# Altium schematic sheet MCU.SchDoc
size A4; PageSetup: Record=PageOptions|CenterHorizontal=True|CenterVertical=True|PrintScale=0.97|XCorrection=1.00|YCorrection=1.00|PrintKind=2|BorderSize=5000000|LeftOffset=0|BottomOffset=0|Orientation=2|PaperLength=1000|PaperWidth=1000|Scale=100|PaperSource=7|PrintQuality=-3|MediaType=1|DitherType=10|PrintScaleMode=1|PaperKind=A4|PaperIndex=9
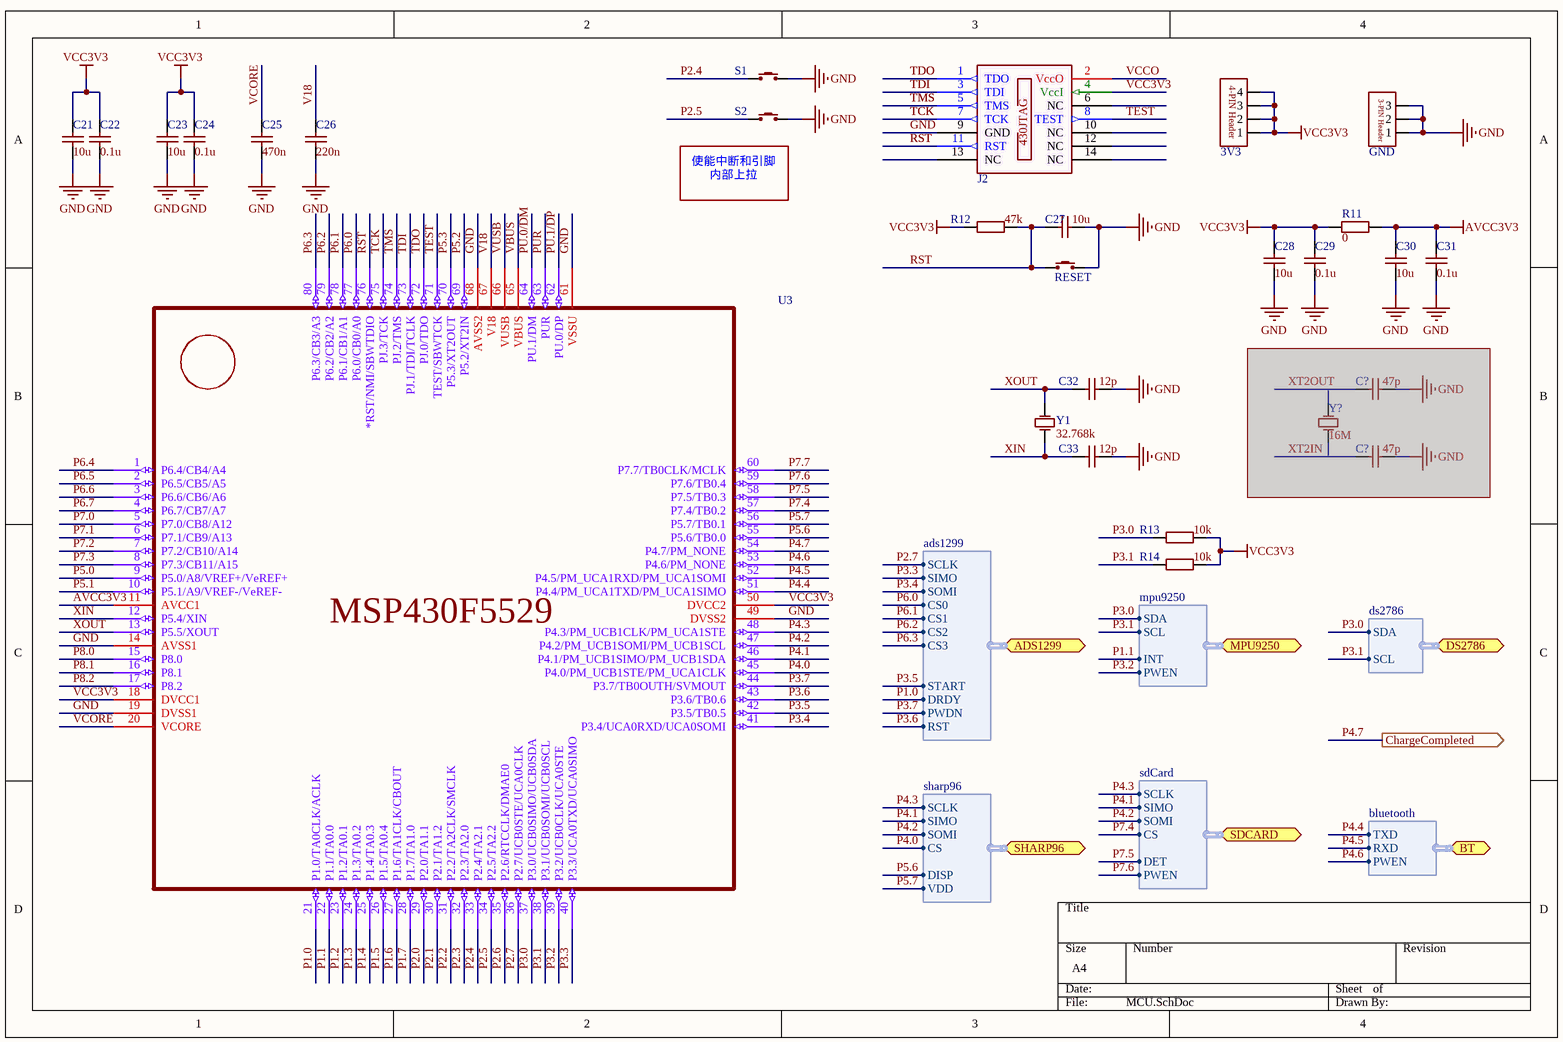
[diagram p0: MCU.SchDoc]

## Parts
(Parts that share a designator on the sheet are numbered #1, #2 ... from top to bottom, then left to right.)
3V3  Header 1X4  [排针1X4 2.54mm]  (value not drawn)
C21  value 10u  [C0402_h]  (hidden comment: Capacitor)
C22  value 0.1u  [C0402_h]  (hidden comment: Capacitor)
C23  value 10u  [C0402_h]  (hidden comment: Capacitor)
C24  value 0.1u  [C0402_h]  (hidden comment: Capacitor)
C25  value 470n  [C0402_h]  (hidden comment: Capacitor)
C26  value 220n  [C0402_h]  (hidden comment: Capacitor)
C27  value 10u  [C0402_h]  (hidden comment: Capacitor)
C28  value 10u  [C0402_h]  (hidden comment: Capacitor)
C29  value 0.1u  [C0402_h]  (hidden comment: Capacitor)
C30  value 10u  [C0402_h]  (hidden comment: Capacitor)
C31  value 0.1u  [C0402_h]  (hidden comment: Capacitor)
C32  value 12p  [C0402_h]  (hidden comment: Capacitor)
C33  value 12p  [C0402_h]  (hidden comment: Capacitor)
C?#1  value 47p  [C0402_h]  (hidden comment: Capacitor)  (masked out: inside a compile mask, not in the netlist)
C?#2  value 47p  [C0402_h]  (hidden comment: Capacitor)  (masked out: inside a compile mask, not in the netlist)
GND  Header1X3  [排针1X3 2.54mm]  (value not drawn)
J2  430JTAG_14  [IDC 2X7]  (value not drawn)
R11  value 0  [R0402]  (hidden comment: Register)
R12  value 47k  [R0402]  (hidden comment: Register)
R13  value 10k  [R0402]  (hidden comment: Register)
R14  value 10k  [R0402]  (hidden comment: Register)
RESET  switch  [贴片开关 6X4]  (value not drawn)
S1  switch  [贴片开关 6X4]  (value not drawn)
S2  switch  [贴片开关 6X4]  (value not drawn)
U3  MSP430F5529_PN_8  [LQFP-80]  (value not drawn)
Y1  value 32.768k  [手表晶振 3x8]  (hidden comment: 晶振)
Y?  value 16M  [手表晶振 3x8]  (hidden comment: 晶振)  (masked out: inside a compile mask, not in the netlist)

## Ports
ADS1299 (harness ads1299), BT (harness bluetooth), ChargeCompleted (out), DS2786 (harness ds2786), MPU9250 (harness mpu9250), SDCARD (harness sdCard), SHARP96 (harness sharp96)

## Harnesses
ads1299: SCLK, SIMO, SOMI, CS0, CS1, CS2, CS3, START, DRDY, PWDN, RST
mpu9250: SCL, SDA, INT, PWEN
sharp96: SCLK, SIMO, SOMI, CS, DISP, VDD
bluetooth: TXD, RXD, PWEN
ds2786: SDA, SCL
sdCard: SCLK, SIMO, SOMI, PWEN, CS, DET

## Nets
AVCC3V3: C30.1 C31.1 R11.1 U3.11(AVCC1)
GND: C21.1 C22.1 C23.1 C24.1 C25.1 C26.1 C27.2 C28.1 C29.1 C30.2 C31.2 C32.2 C33.2 GND.1 GND.2 GND.3 J2.9(GND) RESET.2 S1.2 S2.2 U3.14(AVSS1) U3.19(DVSS1) U3.49(DVSS2) U3.61(VSSU) U3.68(AVSS2)
VCC3V3: 3V3.1 3V3.2 3V3.3 3V3.4 C21.2 C22.2 C23.2 C24.2 C28.2 C29.2 J2.4(VccI) R11.2 R12.1 R13.2 R14.2 U3.18(DVCC1) U3.50(DVCC2)
P1.0: U3.21(P1.0/TA0CLK/ACLK) ; port ADS1299.DRDY
P1.1: U3.22(P1.1/TA0.0) ; port MPU9250.INT
P1.2: U3.23(P1.2/TA0.1)
P1.3: U3.24(P1.3/TA0.2)
P1.4: U3.25(P1.4/TA0.3)
P1.5: U3.26(P1.5/TA0.4)
P1.6: U3.27(P1.6/TA1CLK/CBOUT)
P1.7: U3.28(P1.7/TA1.0)
P2.0: U3.29(P2.0/TA1.1)
P2.1: U3.30(P2.1/TA1.2)
P2.2: U3.31(P2.2/TA2CLK/SMCLK)
P2.3: U3.32(P2.3/TA2.0)
P2.4: S1.1 U3.33(P2.4/TA2.1)
P2.5: S2.1 U3.34(P2.5/TA2.2)
P2.6: U3.35(P2.6/RTCCLK/DMAE0)
P2.7: U3.36(P2.7/UCB0STE/UCA0CLK) ; port ADS1299.SCLK
P3.0: R13.1 U3.37(P3.0/UCB0SIMO/UCB0SDA) ; port MPU9250.SDA, port DS2786.SDA
P3.1: R14.1 U3.38(P3.1/UCB0SOMI/UCB0SCL) ; port MPU9250.SCL, port DS2786.SCL
P3.2: U3.39(P3.2/UCB0CLK/UCA0STE) ; port MPU9250.PWEN
P3.3: U3.40(P3.3/UCA0TXD/UCA0SIMO) ; port ADS1299.SIMO
P3.4: U3.41(P3.4/UCA0RXD/UCA0SOMI) ; port ADS1299.SOMI
P3.5: U3.42(P3.5/TB0.5) ; port ADS1299.START
P3.6: U3.43(P3.6/TB0.6) ; port ADS1299.RST
P3.7: U3.44(P3.7/TB0OUTH/SVMOUT) ; port ADS1299.PWDN
P4.0: U3.45(P4.0/PM_UCB1STE/PM_UCA1CLK) ; port SHARP96.CS
P4.1: U3.46(P4.1/PM_UCB1SIMO/PM_UCB1SDA) ; port SHARP96.SIMO, port SDCARD.SIMO
P4.2: U3.47(P4.2/PM_UCB1SOMI/PM_UCB1SCL) ; port SHARP96.SOMI, port SDCARD.SOMI
P4.3: U3.48(P4.3/PM_UCB1CLK/PM_UCA1STE) ; port SHARP96.SCLK, port SDCARD.SCLK
P4.4: U3.51(P4.4/PM_UCA1TXD/PM_UCA1SIMO) ; port BT.TXD
P4.5: U3.52(P4.5/PM_UCA1RXD/PM_UCA1SOMI) ; port BT.RXD
P4.6: U3.53(P4.6/PM_NONE) ; port BT.PWEN
P4.7: U3.54(P4.7/PM_NONE) ; port ChargeCompleted
P5.0: U3.9(P5.0/A8/VREF+/VeREF+)
P5.1: U3.10(P5.1/A9/VREF-/VeREF-)
P5.2: U3.69(P5.2/XT2IN)
P5.3: U3.70(P5.3/XT2OUT)
P5.6: U3.55(P5.6/TB0.0) ; port SHARP96.DISP
P5.7: U3.56(P5.7/TB0.1) ; port SHARP96.VDD
P6.0: U3.77(P6.0/CB0/A0) ; port ADS1299.CS0
P6.1: U3.78(P6.1/CB1/A1) ; port ADS1299.CS1
P6.2: U3.79(P6.2/CB2/A2) ; port ADS1299.CS2
P6.3: U3.80(P6.3/CB3/A3) ; port ADS1299.CS3
P6.4: U3.1(P6.4/CB4/A4)
P6.5: U3.2(P6.5/CB5/A5)
P6.6: U3.3(P6.6/CB6/A6)
P6.7: U3.4(P6.7/CB7/A7)
P7.0: U3.5(P7.0/CB8/A12)
P7.1: U3.6(P7.1/CB9/A13)
P7.2: U3.7(P7.2/CB10/A14)
P7.3: U3.8(P7.3/CB11/A15)
P7.4: U3.57(P7.4/TB0.2) ; port SDCARD.CS
P7.5: U3.58(P7.5/TB0.3) ; port SDCARD.DET
P7.6: U3.59(P7.6/TB0.4) ; port SDCARD.PWEN
P7.7: U3.60(P7.7/TB0CLK/MCLK)
P8.0: U3.15(P8.0)
P8.1: U3.16(P8.1)
P8.2: U3.17(P8.2)
PU.0/DM: U3.64(PU.1/DM)
PU.1/DP: U3.62(PU.0/DP)
PUR: U3.63(PUR)
RST: C27.1 J2.11(RST) R12.2 RESET.1 U3.76(*RST/NMI/SBWTDIO)
TCK: J2.7(TCK) U3.75(PJ.3/TCK)
TDI: J2.3(TDI) U3.73(PJ.1/TDI/TCLK)
TDO: J2.1(TDO) U3.72(PJ.0/TDO)
TEST: J2.8(TEST) U3.71(TEST/SBWTCK)
TMS: J2.5(TMS) U3.74(PJ.2/TMS)
V18: C26.2 U3.67(V18)
VBUS: U3.65(VBUS)
VCCO: J2.2(VccO)
VCORE: C25.2 U3.20(VCORE)
VUSB: U3.66(VUSB)
XIN: C33.1 U3.12(P5.4/XIN) Y1.2(OSC2)
XOUT: C32.1 U3.13(P5.5/XOUT) Y1.1(OSC1)

Not connected (* = marked no-connect by the designer): J2 6(NC) 10(NC) 12(NC) 13(NC) 14(NC)

## Notes on the sheet
- (near S2) 使能中断和引脚内部上拉
- (in symbol 430JTAG_14) 430JTAG
- (in symbol 排针/排母 1X3) 3-PIN Header
- (in symbol 排针/排母 1X4) 4-PIN Header

## Library data of the parts
3V3 = 排针/排母 1X4: Header, 4-Pin; LatestRevisionDate: 17-Jul-2002; LatestRevisionNote: Re-released for DXP Platform.; Publisher: Altium Limited
C21-C33 C?#1 C?#2 = 贴片电容-无极性: VDC: 10V; Published: 8-Jun-2000; LatestRevisionDate: 17-Jul-2002; LatestRevisionNote: Re-released for DXP Platform.; PackageReference: RAD-0.3; Publisher: Altium Limited; PackageDescription: Radial Cap, Thru-Hole; 2 Leads; 0.3 in Pin Spacing
GND = 排针/排母 1X3: Header, 3-Pin; LatestRevisionDate: 17-Jul-2002; LatestRevisionNote: Re-released for DXP Platform.; Publisher: Altium Limited
J2 = 430JTAG_14: JTAG FOR MSP430 14-PINS
R11-R14 = 贴片电阻
RESET S1 S2 = 按键开关: Published: 24-Mar-1999; LatestRevisionDate: 17-Jul-2002; LatestRevisionNote: Re-released for DXP Platform.; PackageReference: SPST-2; Publisher: Altium Limited; PackageDescription: Switch; 2 Leads
U3 = MSP430F5529_PN_8: Imported; Manufacturer_Part_Number: msp430f5529_pn_80; Vendor: Texas Instruments; PACKAGE_DESIGNATOR: PN; PIN_COUNT: 80; FAMILY_NAME: 5 Series; INDUSTRY_STD_PKG_TYPE: LQFP; GENERIC_PART_NUMBER: MSP430F5529; Datasheet URL: http://www.ti.com/lit/gpn/MSP430F5529; Manufacturer: Texas Instruments; RefDes: RefDes; Type: DEV; Value: Value